# Vivado block design soc, xc7z045ffg900-2, Vivado 2017.3
# (continued, part 2 of 2)
current_bd_instance /datapath/index_cont

create_bd_cell -type ip -vlnv xilinx.com:ip:c_counter_binary:12.0 c_counter_binary_0
set_property -dict [list \
  CONFIG.Implementation Fabric \
  CONFIG.Output_Width 32 \
  CONFIG.Increment_Value 4 \
  CONFIG.Restrict_Count true \
  CONFIG.Final_Count_Value 1FFC \
  CONFIG.CE true \
  CONFIG.SCLR true \
] [get_bd_cells c_counter_binary_0]

# ---- hierarchy /datapath/max_cont ----
current_bd_instance /datapath/max_cont
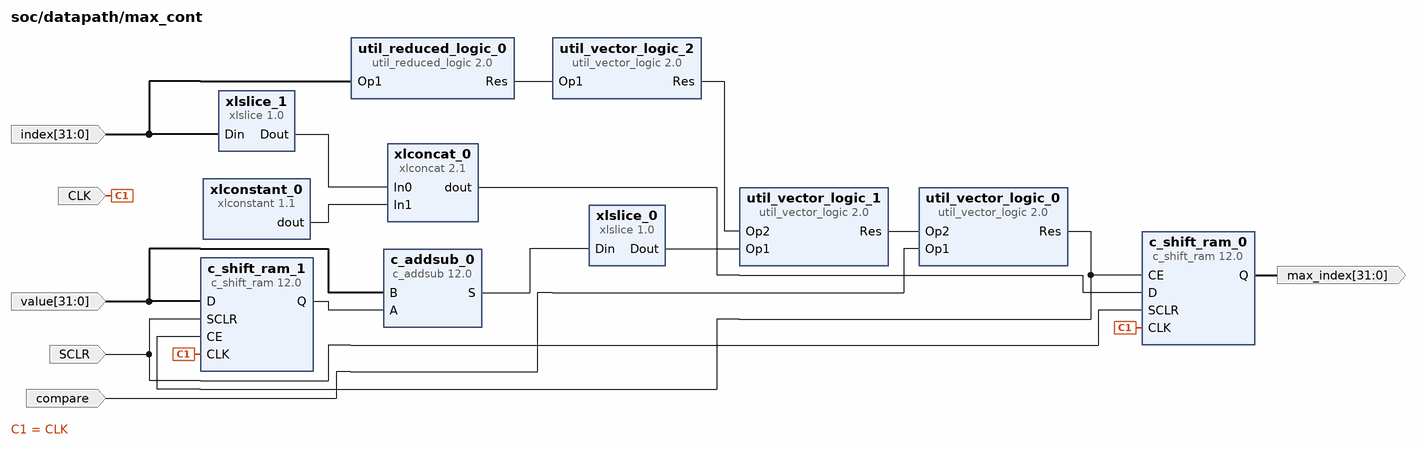
[diagram p15: block diagram inside /datapath/max_cont]
create_bd_pin -dir I -from 31 -to 0 index
create_bd_pin -dir I CLK
create_bd_pin -dir I SCLR
create_bd_pin -dir I compare
create_bd_pin -dir O -from 31 -to 0 max_index
create_bd_pin -dir I -from 31 -to 0 value

create_bd_cell -type ip -vlnv xilinx.com:ip:c_shift_ram:12.0 c_shift_ram_0
set_property -dict [list \
  CONFIG.CE true \
  CONFIG.Width 32 \
  CONFIG.Depth 1 \
  CONFIG.DefaultData 00000000000000000000000000000000 \
  CONFIG.AsyncInitVal 00000000000000000000000000000000 \
  CONFIG.SCLR true \
] [get_bd_cells c_shift_ram_0]
create_bd_cell -type ip -vlnv xilinx.com:ip:c_shift_ram:12.0 c_shift_ram_1
set_property -dict [list \
  CONFIG.CE true \
  CONFIG.Width 32 \
  CONFIG.Depth 1 \
  CONFIG.DefaultData 00000000000000000000000000000000 \
  CONFIG.AsyncInitVal 00000000000000000000000000000000 \
  CONFIG.SCLR true \
] [get_bd_cells c_shift_ram_1]
create_bd_cell -type ip -vlnv xilinx.com:ip:util_vector_logic:2.0 util_vector_logic_0
set_property -dict {CONFIG.C_SIZE 1} [get_bd_cells util_vector_logic_0]
create_bd_cell -type ip -vlnv xilinx.com:ip:c_addsub:12.0 c_addsub_0
set_property -dict [list \
  CONFIG.A_Width 32 \
  CONFIG.B_Width 32 \
  CONFIG.Add_Mode Subtract \
  CONFIG.Out_Width 32 \
  CONFIG.Latency 0 \
  CONFIG.B_Value 00000000000000000000000000000000 \
  CONFIG.CE false \
] [get_bd_cells c_addsub_0]
create_bd_cell -type ip -vlnv xilinx.com:ip:xlslice:1.0 xlslice_0
set_property -dict {CONFIG.DIN_TO 31 CONFIG.DIN_FROM 31 CONFIG.DIN_WIDTH 32 CONFIG.DOUT_WIDTH 1} [get_bd_cells xlslice_0]
create_bd_cell -type ip -vlnv xilinx.com:ip:xlslice:1.0 xlslice_1
set_property -dict {CONFIG.DIN_TO 2 CONFIG.DIN_FROM 31 CONFIG.DOUT_WIDTH 30} [get_bd_cells xlslice_1]
create_bd_cell -type ip -vlnv xilinx.com:ip:xlconcat:2.1 xlconcat_0
set_property -dict {CONFIG.IN0_WIDTH 30 CONFIG.IN1_WIDTH 2} [get_bd_cells xlconcat_0]
create_bd_cell -type ip -vlnv xilinx.com:ip:xlconstant:1.1 xlconstant_0
set_property -dict {CONFIG.CONST_WIDTH 2 CONFIG.CONST_VAL 0} [get_bd_cells xlconstant_0]
create_bd_cell -type ip -vlnv xilinx.com:ip:util_vector_logic:2.0 util_vector_logic_1
set_property -dict {CONFIG.C_SIZE 1 CONFIG.C_OPERATION or} [get_bd_cells util_vector_logic_1]
create_bd_cell -type ip -vlnv xilinx.com:ip:util_reduced_logic:2.0 util_reduced_logic_0
set_property -dict {CONFIG.C_SIZE 32 CONFIG.C_OPERATION or} [get_bd_cells util_reduced_logic_0]
create_bd_cell -type ip -vlnv xilinx.com:ip:util_vector_logic:2.0 util_vector_logic_2
set_property -dict {CONFIG.C_SIZE 1 CONFIG.C_OPERATION not} [get_bd_cells util_vector_logic_2]

# ---- connections ----

current_bd_instance /control_unit
connect_bd_net -net processing_system7_0_FCLK_CLK1 [get_bd_pins CLK] [get_bd_pins avg_err_state/CLK] [get_bd_pins acc_state/CLK]
connect_bd_net [get_bd_pins do_cycle] [get_bd_pins acc_state/do_cycle]
connect_bd_net [get_bd_pins avg_err_state/s_3] [get_bd_pins s_restart] [get_bd_pins util_vector_logic_0/Op1]
connect_bd_net [get_bd_pins acc_state/s_2] [get_bd_pins s_acc]
connect_bd_net [get_bd_pins acc_state/s_3] [get_bd_pins s_addr]
connect_bd_net -net len_cont_not_zero [get_bd_pins len_not_zero] [get_bd_pins avg_err_state/len_not_zero]
connect_bd_net -net cycle_cont_stop_cycle [get_bd_pins stop_cycle] [get_bd_pins avg_err_state/stop_cycle]
connect_bd_net -net util_vector_logic_0_Res [get_bd_pins valid_div] [get_bd_pins avg_err_state/valid_div]
connect_bd_net -net util_vector_logic_1_Res [get_bd_pins valid_sqrt] [get_bd_pins avg_err_state/valid_sqrt]
connect_bd_net [get_bd_pins avg_err_state/s_5] [get_bd_pins s_root]
connect_bd_net [get_bd_pins avg_err_state/s_4] [get_bd_pins s_square]
connect_bd_net [get_bd_pins avg_err_state/s_2] [get_bd_pins s_avg]
connect_bd_net [get_bd_pins avg_err_state/s_0] [get_bd_pins s_wait]
connect_bd_net [get_bd_pins addr_zero] [get_bd_pins avg_err_state/addr_zero]
connect_bd_net [get_bd_pins valid_zncc] [get_bd_pins avg_err_state/valid_zncc]
connect_bd_net [get_bd_pins avg_err_state/s_6] [get_bd_pins s_zncc]
connect_bd_net [get_bd_pins avg_err_state/s_7] [get_bd_pins s_done]
connect_bd_net [get_bd_pins SCLR] [get_bd_pins util_vector_logic_0/Op2] [get_bd_pins avg_err_state/SCLR]
connect_bd_net [get_bd_pins util_vector_logic_0/Res] [get_bd_pins acc_state/SCLR]
connect_bd_net [get_bd_pins xlconcat_0/dout] [get_bd_pins states]
connect_bd_net [get_bd_pins acc_state/state] [get_bd_pins xlconcat_0/In0]
connect_bd_net [get_bd_pins avg_err_state/state] [get_bd_pins xlconcat_0/In1]
connect_bd_net [get_bd_pins xlconstant_0/dout] [get_bd_pins xlconcat_0/In2]

current_bd_instance /control_unit/acc_state
connect_bd_net -net processing_system7_0_FCLK_CLK1 [get_bd_pins CLK] [get_bd_pins c_counter_binary_0/CLK]
connect_bd_net [get_bd_pins SCLR] [get_bd_pins c_counter_binary_0/SCLR]
connect_bd_net [get_bd_pins c_counter_binary_0/Q] [get_bd_pins state] [get_bd_pins x_0/Din] [get_bd_pins x_1/Din]
connect_bd_net [get_bd_pins x_0/Dout] [get_bd_pins n_x_0/Op1] [get_bd_pins s_1/Op1] [get_bd_pins s_3/Op1]
connect_bd_net [get_bd_pins x_1/Dout] [get_bd_pins n_x_1/Op1] [get_bd_pins s_2/Op2] [get_bd_pins s_3/Op2]
connect_bd_net [get_bd_pins n_x_0/Res] [get_bd_pins s_0/Op1] [get_bd_pins s_2/Op1]
connect_bd_net [get_bd_pins n_x_1/Res] [get_bd_pins s_0/Op2] [get_bd_pins s_1/Op2]
connect_bd_net [get_bd_pins s_0/Res] [get_bd_pins s_0] [get_bd_pins s_0_c/Op2]
connect_bd_net [get_bd_pins s_1/Res] [get_bd_pins s_1] [get_bd_pins xlconcat_0/In1]
connect_bd_net [get_bd_pins s_2/Res] [get_bd_pins s_2] [get_bd_pins xlconcat_0/In2]
connect_bd_net [get_bd_pins s_3/Res] [get_bd_pins s_3] [get_bd_pins xlconcat_0/In3]
connect_bd_net [get_bd_pins xlconcat_0/dout] [get_bd_pins util_reduced_logic_0/Op1]
connect_bd_net [get_bd_pins util_reduced_logic_0/Res] [get_bd_pins c_counter_binary_0/CE]
connect_bd_net [get_bd_pins do_cycle] [get_bd_pins s_0_c/Op1]
connect_bd_net [get_bd_pins s_0_c/Res] [get_bd_pins xlconcat_0/In0]

current_bd_instance /control_unit/avg_err_state
connect_bd_net -net processing_system7_0_FCLK_CLK1 [get_bd_pins CLK] [get_bd_pins c_counter_binary_0/CLK]
connect_bd_net [get_bd_pins c_counter_binary_0/Q] \
  [get_bd_pins state] [get_bd_pins x_2/Din] [get_bd_pins x_3/Din] [get_bd_pins x_1/Din] [get_bd_pins x_0/Din]
connect_bd_net [get_bd_pins x_0/Dout] [get_bd_pins c_1/In0] [get_bd_pins c_3/In0] [get_bd_pins c_5/In0] [get_bd_pins c_7/In0] [get_bd_pins n_x_0/Op1]
connect_bd_net [get_bd_pins x_2/Dout] [get_bd_pins c_4/In2] [get_bd_pins c_5/In2] [get_bd_pins c_6/In2] [get_bd_pins c_7/In2] [get_bd_pins n_x_2/Op1]
connect_bd_net [get_bd_pins n_x_0/Res] [get_bd_pins c_0/In0] [get_bd_pins c_2/In0] [get_bd_pins c_4/In0] [get_bd_pins c_6/In0] [get_bd_pins c_8/In0]
connect_bd_net [get_bd_pins n_x_1/Res] [get_bd_pins c_0/In1] [get_bd_pins c_1/In1] [get_bd_pins c_4/In1] [get_bd_pins c_5/In1] [get_bd_pins c_8/In1]
connect_bd_net [get_bd_pins n_x_2/Res] [get_bd_pins c_0/In2] [get_bd_pins c_1/In2] [get_bd_pins c_2/In2] [get_bd_pins c_3/In2] [get_bd_pins c_8/In2]
connect_bd_net [get_bd_pins n_x_3/Res] \
  [get_bd_pins c_0/In3] [get_bd_pins c_1/In3] [get_bd_pins c_2/In3] [get_bd_pins c_3/In3] [get_bd_pins c_4/In3] \
  [get_bd_pins c_5/In3] [get_bd_pins c_6/In3] [get_bd_pins c_7/In3]
connect_bd_net [get_bd_pins c_0/dout] [get_bd_pins s_0/Op1]
connect_bd_net [get_bd_pins c_1/dout] [get_bd_pins s_1/Op1]
connect_bd_net [get_bd_pins x_1/Dout] [get_bd_pins c_2/In1] [get_bd_pins c_3/In1] [get_bd_pins c_6/In1] [get_bd_pins c_7/In1] [get_bd_pins n_x_1/Op1]
connect_bd_net [get_bd_pins c_2/dout] [get_bd_pins s_2/Op1]
connect_bd_net [get_bd_pins c_3/dout] [get_bd_pins s_3/Op1]
connect_bd_net [get_bd_pins c_4/dout] [get_bd_pins s_4/Op1]
connect_bd_net [get_bd_pins c_5/dout] [get_bd_pins s_5/Op1]
connect_bd_net [get_bd_pins c_6/dout] [get_bd_pins s_6/Op1]
connect_bd_net [get_bd_pins c_7/dout] [get_bd_pins s_7/Op1]
connect_bd_net -net slicer_cont_x_3 [get_bd_pins x_3/Dout] [get_bd_pins c_8/In3] [get_bd_pins n_x_3/Op1]
connect_bd_net [get_bd_pins c_8/dout] [get_bd_pins s_8/Op1]
connect_bd_net [get_bd_pins s_3/Res] [get_bd_pins s_3] [get_bd_pins util_vector_logic_5/Op1]
connect_bd_net [get_bd_pins s_8/Res] [get_bd_pins s_8] [get_bd_pins util_vector_logic_7/Op1]
connect_bd_net [get_bd_pins s_5/Res] [get_bd_pins s_5] [get_bd_pins util_vector_logic_4/Op1]
connect_bd_net [get_bd_pins s_4/Res] [get_bd_pins s_4] [get_bd_pins util_vector_logic_3/Op1]
connect_bd_net [get_bd_pins s_6/Res] [get_bd_pins s_6] [get_bd_pins util_vector_logic_6/Op1]
connect_bd_net [get_bd_pins s_7/Res] [get_bd_pins s_7] [get_bd_pins xlconcat_0/In7]
connect_bd_net [get_bd_pins s_1/Res] [get_bd_pins s_1] [get_bd_pins util_vector_logic_1/Op1]
connect_bd_net [get_bd_pins s_2/Res] [get_bd_pins s_2] [get_bd_pins util_vector_logic_2/Op1]
connect_bd_net [get_bd_pins s_0/Res] [get_bd_pins s_0] [get_bd_pins util_vector_logic_0/Op1]
connect_bd_net -net avg_err_logic_enable [get_bd_pins util_reduced_logic_0/Res] [get_bd_pins c_counter_binary_0/CE]
connect_bd_net [get_bd_pins len_not_zero] [get_bd_pins util_vector_logic_0/Op2]
connect_bd_net [get_bd_pins stop_cycle] [get_bd_pins util_vector_logic_1/Op2] [get_bd_pins util_vector_logic_3/Op2]
connect_bd_net [get_bd_pins valid_div] [get_bd_pins util_vector_logic_2/Op2]
connect_bd_net [get_bd_pins valid_sqrt] [get_bd_pins util_vector_logic_4/Op2]
connect_bd_net [get_bd_pins util_vector_logic_0/Res] [get_bd_pins xlconcat_0/In0]
connect_bd_net [get_bd_pins util_vector_logic_1/Res] [get_bd_pins xlconcat_0/In1]
connect_bd_net [get_bd_pins util_vector_logic_2/Res] [get_bd_pins xlconcat_0/In2]
connect_bd_net [get_bd_pins util_vector_logic_3/Res] [get_bd_pins xlconcat_0/In4]
connect_bd_net [get_bd_pins util_vector_logic_4/Res] [get_bd_pins xlconcat_0/In5]
connect_bd_net [get_bd_pins xlconcat_0/dout] [get_bd_pins util_reduced_logic_0/Op1]
connect_bd_net [get_bd_pins util_vector_logic_5/Res] [get_bd_pins xlconcat_0/In3]
connect_bd_net [get_bd_pins addr_zero] [get_bd_pins util_vector_logic_5/Op2]
connect_bd_net [get_bd_pins util_vector_logic_6/Res] [get_bd_pins xlconcat_0/In6]
connect_bd_net [get_bd_pins valid_zncc] [get_bd_pins util_vector_logic_6/Op2]
connect_bd_net [get_bd_pins xlconstant_0/dout] [get_bd_pins xlconcat_0/In8]
connect_bd_net [get_bd_pins util_vector_logic_7/Res] [get_bd_pins c_counter_binary_0/SCLR]
connect_bd_net [get_bd_pins SCLR] [get_bd_pins util_vector_logic_7/Op2]

current_bd_instance /datapath
connect_bd_intf_net -intf_net axi_bram_ctrl_0_BRAM_PORTA1 [get_bd_intf_pins BRAM_PORTA0] [get_bd_intf_pins bram_pair/BRAM_PORTA1]
connect_bd_intf_net -intf_net axi_bram_ctrl_0_BRAM_PORTA [get_bd_intf_pins BRAM_PORTA1] [get_bd_intf_pins bram_pair/BRAM_PORTA0]
connect_bd_intf_net [get_bd_intf_pins BRAM_PORTA2] [get_bd_intf_pins bram_res/BRAM_PORTA]
connect_bd_net [get_bd_pins addr_cont/addr] [get_bd_pins cycle_cont/addr] [get_bd_pins bram_pair/addr] [get_bd_pins acc_group/addr]
connect_bd_net [get_bd_pins len_cont/len_off] [get_bd_pins cycle_cont/len]
connect_bd_net -net bram_cont_long_sel [get_bd_pins bram_pair/long_sel_0] [get_bd_pins len_cont/len_in] [get_bd_pins acc_group/long_in0]
connect_bd_net -net long_in_1 [get_bd_pins bram_pair/long_sel_1] [get_bd_pins acc_group/long_in1]
connect_bd_net -net divisor_1 [get_bd_pins len_cont/len] [get_bd_pins avg_pair/divisor]
connect_bd_net -net util_vector_logic_1_Res [get_bd_pins err_pair/valid_sqrt] [get_bd_pins valid_sqrt]
connect_bd_net -net processing_system7_0_FCLK_CLK1 [get_bd_pins CLK] \
  [get_bd_pins len_cont/CLK] [get_bd_pins bram_pair/CLK] [get_bd_pins avg_pair/CLK] [get_bd_pins acc_group/CLK] \
  [get_bd_pins err_pair/CLK] [get_bd_pins zncc_cont/CLK] [get_bd_pins bram_res/CLK] [get_bd_pins index_cont/CLK] \
  [get_bd_pins addr_cont/CLK] [get_bd_pins max_cont/CLK]
connect_bd_net -net avg_err_state_s_5 [get_bd_pins s_root] [get_bd_pins err_pair/s_root]
connect_bd_net -net do_cycle_1 [get_bd_pins cycle_cont/do_cycle] [get_bd_pins do_cycle]
connect_bd_net [get_bd_pins cycle_cont/stop_cycle] [get_bd_pins stop_cycle]
connect_bd_net [get_bd_pins len_cont/not_zero] [get_bd_pins len_not_zero] [get_bd_pins cycle_cont/len_not_zero] [get_bd_pins bram_pair/clear_len]
connect_bd_net -net acc_state_s_2 [get_bd_pins s_acc] [get_bd_pins acc_group/s_acc]
connect_bd_net -net avg_err_state_s_3 [get_bd_pins s_restart] [get_bd_pins acc_group/s_restart] [get_bd_pins addr_cont/s_restart]
connect_bd_net -net avg_err_state_s_4 [get_bd_pins s_square] [get_bd_pins acc_group/s_square]
connect_bd_net -net acc_state_s_3 [get_bd_pins s_addr] [get_bd_pins addr_cont/CE]
connect_bd_net -net addr_zero_1 [get_bd_pins addr_cont/zero] [get_bd_pins addr_zero]
connect_bd_net -net avg_err_state_s_0 [get_bd_pins s_wait] [get_bd_pins len_cont/CE]
connect_bd_net -net avg_err_state_s_2 [get_bd_pins s_avg] [get_bd_pins avg_pair/s_avg]
connect_bd_net -net avg0_1 [get_bd_pins avg_pair/avg0] [get_bd_pins acc_group/avg0]
connect_bd_net [get_bd_pins avg_pair/avg1] [get_bd_pins acc_group/avg1]
connect_bd_net [get_bd_pins acc_group/acc0] [get_bd_pins avg_pair/dividend0] [get_bd_pins err_pair/num0]
connect_bd_net [get_bd_pins acc_group/acc1] [get_bd_pins avg_pair/dividend1] [get_bd_pins err_pair/num1]
connect_bd_net [get_bd_pins avg_pair/valid_div] [get_bd_pins valid_div]
connect_bd_net [get_bd_pins err_pair/norm] [get_bd_pins zncc_cont/norm]
connect_bd_net [get_bd_pins acc_group/acc2] [get_bd_pins zncc_cont/cc]
connect_bd_net [get_bd_pins s_zncc] [get_bd_pins zncc_cont/s_zncc] [get_bd_pins len_cont/s_zncc] [get_bd_pins addr_cont/s_zncc]
connect_bd_net [get_bd_pins zncc_cont/valid_zncc] [get_bd_pins valid_zncc] [get_bd_pins bram_res/save] [get_bd_pins max_cont/compare]
connect_bd_net [get_bd_pins zncc_cont/zncc] [get_bd_pins debug_2] [get_bd_pins bram_res/zncc_val] [get_bd_pins max_cont/value]
connect_bd_net [get_bd_pins s_done] [get_bd_pins index_cont/s_done] [get_bd_pins acc_group/s_done]
connect_bd_net -net c_counter_binary_0_Q [get_bd_pins index_cont/index] [get_bd_pins bram_res/index] [get_bd_pins max_cont/index]
connect_bd_net -net SCLR_1 [get_bd_pins len_cont/clear] \
  [get_bd_pins clear] [get_bd_pins index_cont/SCLR] [get_bd_pins addr_cont/SCLR] [get_bd_pins acc_group/SCLR] \
  [get_bd_pins max_cont/SCLR]
connect_bd_net [get_bd_pins max_cont/max_index] [get_bd_pins max_index]

current_bd_instance /datapath/cycle_cont
connect_bd_net [get_bd_pins c_addsub_0/S] [get_bd_pins xlslice_0/Din]
connect_bd_net -net c_counter_binary_0_Q [get_bd_pins addr] [get_bd_pins c_addsub_0/A]
connect_bd_net -net len_cont_len [get_bd_pins len] [get_bd_pins c_addsub_0/B]
connect_bd_net [get_bd_pins util_vector_logic_0/Res] [get_bd_pins stop_cycle]
connect_bd_net [get_bd_pins len_not_zero] [get_bd_pins util_vector_logic_1/Op2]
connect_bd_net [get_bd_pins xlslice_0/Dout] [get_bd_pins util_vector_logic_1/Op1]
connect_bd_net [get_bd_pins util_vector_logic_1/Res] [get_bd_pins do_cycle] [get_bd_pins util_vector_logic_0/Op1]

current_bd_instance /datapath/addr_cont
connect_bd_net [get_bd_pins c_counter_binary_0/Q] [get_bd_pins addr] [get_bd_pins util_reduced_logic_0/Op1]
connect_bd_net [get_bd_pins CE] [get_bd_pins c_counter_binary_0/CE]
connect_bd_net [get_bd_pins util_reduced_logic_0/Res] [get_bd_pins not_zero] [get_bd_pins util_vector_logic_0/Op1]
connect_bd_net [get_bd_pins util_vector_logic_0/Res] [get_bd_pins zero]
connect_bd_net [get_bd_pins CLK] [get_bd_pins c_counter_binary_0/CLK]
connect_bd_net -net s_reset_1 [get_bd_pins s_restart] [get_bd_pins util_vector_logic_1/Op1]
connect_bd_net [get_bd_pins util_vector_logic_1/Res] [get_bd_pins util_vector_logic_2/Op1]
connect_bd_net [get_bd_pins s_zncc] [get_bd_pins util_vector_logic_1/Op2]
connect_bd_net [get_bd_pins SCLR] [get_bd_pins util_vector_logic_2/Op2]
connect_bd_net [get_bd_pins util_vector_logic_2/Res] [get_bd_pins c_counter_binary_0/SCLR]

current_bd_instance /datapath/len_cont
connect_bd_net -net axi_bram_ctrl_0_bram_doutb [get_bd_pins len_in] [get_bd_pins c_shift_ram_0/D]
connect_bd_net -net processing_system7_0_FCLK_CLK1 [get_bd_pins CLK] [get_bd_pins c_shift_ram_0/CLK]
connect_bd_net [get_bd_pins c_shift_ram_0/Q] \
  [get_bd_pins len] [get_bd_pins util_reduced_logic_0/Op1] [get_bd_pins c_addsub_0/A] [get_bd_pins util_reduced_logic_1/Op1]
connect_bd_net [get_bd_pins CE] [get_bd_pins c_shift_ram_0/CE]
connect_bd_net [get_bd_pins util_reduced_logic_0/Res] [get_bd_pins not_zero] [get_bd_pins util_vector_logic_0/Op1]
connect_bd_net [get_bd_pins util_vector_logic_0/Res] [get_bd_pins zero]
connect_bd_net [get_bd_pins c_addsub_0/S] [get_bd_pins len_off]
connect_bd_net [get_bd_pins util_reduced_logic_1/Res] [get_bd_pins clear] [get_bd_pins util_vector_logic_1/Op2]
connect_bd_net [get_bd_pins s_zncc] [get_bd_pins util_vector_logic_1/Op1]
connect_bd_net [get_bd_pins util_vector_logic_1/Res] [get_bd_pins c_shift_ram_0/SCLR]

current_bd_instance /datapath/bram_pair
connect_bd_intf_net -intf_net axi_bram_ctrl_0_BRAM_PORTA [get_bd_intf_pins BRAM_PORTA0] [get_bd_intf_pins axi_bram_ctrl_0_bram_1/BRAM_PORTA]
connect_bd_intf_net -intf_net axi_bram_ctrl_0_BRAM_PORTA1 [get_bd_intf_pins BRAM_PORTA1] [get_bd_intf_pins axi_bram_ctrl_0_bram/BRAM_PORTA]
connect_bd_net -net processing_system7_0_FCLK_CLK1 [get_bd_pins CLK] [get_bd_pins axi_bram_ctrl_0_bram/clkb] [get_bd_pins axi_bram_ctrl_0_bram_1/clkb]
connect_bd_net -net addr_cont_addr [get_bd_pins addr] \
  [get_bd_pins axi_bram_ctrl_0_bram/addrb] [get_bd_pins axi_bram_ctrl_0_bram_1/addrb] [get_bd_pins xlslice_7/Din]
connect_bd_net -net bram_cont_long_sel [get_bd_pins axi_bram_ctrl_0_bram_1/doutb] [get_bd_pins long_sel_0]
connect_bd_net -net long_in_1 [get_bd_pins axi_bram_ctrl_0_bram/doutb] [get_bd_pins long_sel_1]
connect_bd_net -net xlconstant_0_dout_1 [get_bd_pins xlconstant_1/dout] \
  [get_bd_pins axi_bram_ctrl_0_bram_1/enb] [get_bd_pins axi_bram_ctrl_0_bram/enb]
connect_bd_net [get_bd_pins xlconstant_0/dout] [get_bd_pins axi_bram_ctrl_0_bram_1/dinb]
connect_bd_net [get_bd_pins xlconcat_0/dout] [get_bd_pins axi_bram_ctrl_0_bram_1/web]
connect_bd_net -net xlslice_3_Dout_1 [get_bd_pins xlslice_7/Dout] [get_bd_pins util_reduced_logic_1/Op1]
connect_bd_net [get_bd_pins util_vector_logic_1/Res] \
  [get_bd_pins xlconcat_0/In0] [get_bd_pins xlconcat_0/In1] [get_bd_pins xlconcat_0/In2] [get_bd_pins xlconcat_0/In3]
connect_bd_net [get_bd_pins util_reduced_logic_1/Res] [get_bd_pins util_vector_logic_2/Op1]
connect_bd_net [get_bd_pins util_vector_logic_2/Res] [get_bd_pins util_vector_logic_1/Op1]
connect_bd_net -net clear_current_1 [get_bd_pins clear_len] [get_bd_pins util_vector_logic_1/Op2]

current_bd_instance /datapath/avg_pair
connect_bd_net -net avg_in0_1 [get_bd_pins xlslice_0/Dout] [get_bd_pins c_shift_ram_0/D]
connect_bd_net -net avg_in1_1 [get_bd_pins xlslice_1/Dout] [get_bd_pins c_shift_ram_1/D]
connect_bd_net -net div_cont1_valid_out [get_bd_pins div_gen_1/m_axis_dout_tvalid] \
  [get_bd_pins util_vector_logic_0/Op2] [get_bd_pins c_shift_ram_1/CE]
connect_bd_net -net processing_system7_0_FCLK_CLK1 [get_bd_pins CLK] \
  [get_bd_pins c_shift_ram_0/CLK] [get_bd_pins c_shift_ram_1/CLK] [get_bd_pins div_gen_0/aclk] [get_bd_pins div_gen_1/aclk]
connect_bd_net -net div_cont_valid_out [get_bd_pins div_gen_0/m_axis_dout_tvalid] [get_bd_pins util_vector_logic_0/Op1] [get_bd_pins c_shift_ram_0/CE]
connect_bd_net -net avg_pair_avg0 [get_bd_pins c_shift_ram_0/Q] [get_bd_pins avg0]
connect_bd_net -net avg_pair_avg1 [get_bd_pins c_shift_ram_1/Q] [get_bd_pins avg1]
connect_bd_net -net avg_err_state_s_2 [get_bd_pins s_avg] \
  [get_bd_pins div_gen_0/s_axis_dividend_tvalid] [get_bd_pins div_gen_0/s_axis_divisor_tvalid] \
  [get_bd_pins div_gen_1/s_axis_dividend_tvalid] [get_bd_pins div_gen_1/s_axis_divisor_tvalid]
connect_bd_net [get_bd_pins divisor] [get_bd_pins div_gen_0/s_axis_divisor_tdata] [get_bd_pins div_gen_1/s_axis_divisor_tdata]
connect_bd_net [get_bd_pins div_gen_0/m_axis_dout_tdata] [get_bd_pins xlslice_0/Din]
connect_bd_net -net div_gen_0_m_axis_dout_tdata_1 [get_bd_pins div_gen_1/m_axis_dout_tdata] [get_bd_pins xlslice_1/Din]
connect_bd_net -net s_axis_dividend_tdata_0_1 [get_bd_pins dividend0] [get_bd_pins div_gen_0/s_axis_dividend_tdata]
connect_bd_net -net s_axis_dividend_tdata_1_1 [get_bd_pins dividend1] [get_bd_pins div_gen_1/s_axis_dividend_tdata]
connect_bd_net [get_bd_pins util_vector_logic_0/Res] [get_bd_pins valid_div]

current_bd_instance /datapath/acc_group
connect_bd_net -net processing_system7_0_FCLK_CLK1 [get_bd_pins CLK] \
  [get_bd_pins xbip_dsp48_macro_0/CLK] [get_bd_pins xbip_dsp48_macro_3/CLK] [get_bd_pins xbip_dsp48_macro_6/CLK]
connect_bd_net -net acc_state_s_2 [get_bd_pins s_acc] [get_bd_pins util_vector_logic_1/Op2]
connect_bd_net -net avg_err_state_s_3 [get_bd_pins util_vector_logic_0/Res] \
  [get_bd_pins xbip_dsp48_macro_0/SCLR] [get_bd_pins xbip_dsp48_macro_3/SCLR] [get_bd_pins xbip_dsp48_macro_6/SCLR]
connect_bd_net -net avg_err_state_s_4 [get_bd_pins s_square] \
  [get_bd_pins xbip_dsp48_macro_0/SEL] [get_bd_pins xbip_dsp48_macro_3/SEL] [get_bd_pins xlconcat_9/In1]
connect_bd_net -net addr_cont_addr [get_bd_pins addr] [get_bd_pins xlslice_5/Din] [get_bd_pins xlslice_7/Din]
connect_bd_net -net util_vector_logic_0_Res_1 [get_bd_pins util_vector_logic_1/Res] \
  [get_bd_pins xbip_dsp48_macro_3/CE] [get_bd_pins xbip_dsp48_macro_0/CE] [get_bd_pins xbip_dsp48_macro_6/CE]
connect_bd_net -net xlslice_1_Dout_1 [get_bd_pins xlslice_5/Dout] \
  [get_bd_pins xbip_dsp48_macro_1/SEL] [get_bd_pins xbip_dsp48_macro_4/SEL] [get_bd_pins xlconcat_9/In0]
connect_bd_net -net xlconcat_0_dout2 [get_bd_pins xlconcat_9/dout] [get_bd_pins xbip_dsp48_macro_2/SEL] [get_bd_pins xbip_dsp48_macro_5/SEL]
connect_bd_net -net avg1_1 [get_bd_pins avg1] [get_bd_pins xbip_dsp48_macro_2/C]
connect_bd_net -net avg0_1 [get_bd_pins avg0] [get_bd_pins xbip_dsp48_macro_5/C]
connect_bd_net -net long_in1_1 [get_bd_pins long_in1] [get_bd_pins b_10/Din] [get_bd_pins b_12/Din] [get_bd_pins b_13/Din] [get_bd_pins b_11/Din]
connect_bd_net -net long_in0_1 [get_bd_pins long_in0] [get_bd_pins b_02/Din] [get_bd_pins b_01/Din] [get_bd_pins b_03/Din] [get_bd_pins b_00/Din]
connect_bd_net [get_bd_pins xbip_dsp48_macro_3/P] [get_bd_pins acc0]
connect_bd_net [get_bd_pins xbip_dsp48_macro_0/P] [get_bd_pins acc1]
connect_bd_net [get_bd_pins xbip_dsp48_macro_6/P] [get_bd_pins acc2]
connect_bd_net -net byte_adapter_db_00 [get_bd_pins xlconcat_5/dout] [get_bd_pins xbip_dsp48_macro_4/A]
connect_bd_net -net byte_adapter_db_01 [get_bd_pins xlconcat_6/dout] [get_bd_pins xbip_dsp48_macro_4/C]
connect_bd_net -net byte_adapter_db_02 [get_bd_pins xlconcat_7/dout] [get_bd_pins xbip_dsp48_macro_4/D]
connect_bd_net -net xbip_dsp48_macro_1_P_1 [get_bd_pins xbip_dsp48_macro_4/P] [get_bd_pins xbip_dsp48_macro_5/A]
connect_bd_net -net byte_adapter_db_03 [get_bd_pins xlconcat_8/dout] [get_bd_pins xbip_dsp48_macro_5/D]
connect_bd_net -net byte_adapter_db_10 [get_bd_pins xlconcat_1/dout] [get_bd_pins xbip_dsp48_macro_1/A]
connect_bd_net -net byte_adapter_db_11 [get_bd_pins xlconcat_2/dout] [get_bd_pins xbip_dsp48_macro_1/C]
connect_bd_net -net byte_adapter_db_12 [get_bd_pins xlconcat_3/dout] [get_bd_pins xbip_dsp48_macro_1/D]
connect_bd_net [get_bd_pins xbip_dsp48_macro_1/P] [get_bd_pins xbip_dsp48_macro_2/A]
connect_bd_net -net byte_adapter_db_13 [get_bd_pins xlconcat_4/dout] [get_bd_pins xbip_dsp48_macro_2/D]
connect_bd_net -net b_1_Dout [get_bd_pins b_11/Dout] [get_bd_pins xlconcat_2/In1]
connect_bd_net -net b_2_Dout [get_bd_pins b_12/Dout] [get_bd_pins xlconcat_3/In1]
connect_bd_net -net b_3_Dout [get_bd_pins b_13/Dout] [get_bd_pins xlconcat_4/In1]
connect_bd_net -net b_0_Dout_1 [get_bd_pins b_00/Dout] [get_bd_pins xlconcat_5/In1]
connect_bd_net -net b_1_Dout_1 [get_bd_pins b_01/Dout] [get_bd_pins xlconcat_6/In1]
connect_bd_net [get_bd_pins xlconstant_0/dout] \
  [get_bd_pins xlconcat_2/In0] [get_bd_pins xlconcat_1/In0] [get_bd_pins xlconcat_3/In0] [get_bd_pins xlconcat_4/In0] \
  [get_bd_pins xlconcat_6/In0] [get_bd_pins xlconcat_5/In0] [get_bd_pins xlconcat_7/In0] [get_bd_pins xlconcat_8/In0]
connect_bd_net -net b_0_Dout [get_bd_pins b_10/Dout] [get_bd_pins xlconcat_1/In1]
connect_bd_net [get_bd_pins xlconstant_2/dout] \
  [get_bd_pins xlconcat_2/In2] [get_bd_pins xlconcat_1/In2] [get_bd_pins xlconcat_3/In2] [get_bd_pins xlconcat_4/In2] \
  [get_bd_pins xlconcat_6/In2] [get_bd_pins xlconcat_5/In2] [get_bd_pins xlconcat_7/In2] [get_bd_pins xlconcat_8/In2]
connect_bd_net -net b_2_Dout_1 [get_bd_pins b_02/Dout] [get_bd_pins xlconcat_7/In1]
connect_bd_net -net b_3_Dout_1 [get_bd_pins b_03/Dout] [get_bd_pins xlconcat_8/In1]
connect_bd_net -net util_reduced_logic_0_Res_1 [get_bd_pins util_reduced_logic_1/Res] [get_bd_pins util_vector_logic_1/Op1]
connect_bd_net -net xlslice_3_Dout_1 [get_bd_pins xlslice_7/Dout] [get_bd_pins util_reduced_logic_1/Op1]
connect_bd_net [get_bd_pins xbip_dsp48_macro_5/P] [get_bd_pins xlslice_0/Din]
connect_bd_net [get_bd_pins xlslice_0/Dout] [get_bd_pins xbip_dsp48_macro_3/A] [get_bd_pins xbip_dsp48_macro_3/B] [get_bd_pins xbip_dsp48_macro_6/A]
connect_bd_net [get_bd_pins xbip_dsp48_macro_2/P] [get_bd_pins xlslice_1/Din]
connect_bd_net [get_bd_pins xlslice_1/Dout] [get_bd_pins xbip_dsp48_macro_0/A] [get_bd_pins xbip_dsp48_macro_0/B] [get_bd_pins xbip_dsp48_macro_6/B]
connect_bd_net [get_bd_pins s_restart] [get_bd_pins util_vector_logic_2/Op2]
connect_bd_net [get_bd_pins s_done] [get_bd_pins util_vector_logic_0/Op2]
connect_bd_net [get_bd_pins SCLR] [get_bd_pins util_vector_logic_2/Op1]
connect_bd_net [get_bd_pins util_vector_logic_2/Res] [get_bd_pins util_vector_logic_0/Op1]

current_bd_instance /datapath/err_pair
connect_bd_net -net valid_sqrt_1 [get_bd_pins cordic_0/m_axis_dout_tvalid] [get_bd_pins util_vector_logic_1/Op1]
connect_bd_net -net sqrt_cont1_valid_out [get_bd_pins cordic_1/m_axis_dout_tvalid] [get_bd_pins util_vector_logic_1/Op2]
connect_bd_net [get_bd_pins util_vector_logic_1/Res] [get_bd_pins valid_sqrt] [get_bd_pins c_shift_ram_0/CE]
connect_bd_net -net processing_system7_0_FCLK_CLK1 [get_bd_pins CLK] \
  [get_bd_pins c_shift_ram_0/CLK] [get_bd_pins cordic_0/aclk] [get_bd_pins cordic_1/aclk]
connect_bd_net -net avg_err_state_s_5 [get_bd_pins s_root] \
  [get_bd_pins cordic_0/s_axis_cartesian_tvalid] [get_bd_pins cordic_1/s_axis_cartesian_tvalid]
connect_bd_net [get_bd_pins cordic_0/m_axis_dout_tdata] [get_bd_pins mult_gen_0/A]
connect_bd_net [get_bd_pins cordic_1/m_axis_dout_tdata] [get_bd_pins mult_gen_0/B]
connect_bd_net [get_bd_pins mult_gen_0/P] [get_bd_pins c_shift_ram_0/D]
connect_bd_net [get_bd_pins c_shift_ram_0/Q] [get_bd_pins norm]
connect_bd_net -net num0_1 [get_bd_pins num0] [get_bd_pins xlslice_0/Din]
connect_bd_net [get_bd_pins xlslice_0/Dout] [get_bd_pins xlconcat_0/In1]
connect_bd_net [get_bd_pins xlconcat_0/dout] [get_bd_pins cordic_0/s_axis_cartesian_tdata]
connect_bd_net [get_bd_pins xlconstant_0/dout] [get_bd_pins xlconcat_0/In0] [get_bd_pins xlconcat_1/In0]
connect_bd_net -net num1_1 [get_bd_pins num1] [get_bd_pins xlslice_1/Din]
connect_bd_net [get_bd_pins xlslice_1/Dout] [get_bd_pins xlconcat_1/In1]
connect_bd_net [get_bd_pins xlconcat_1/dout] [get_bd_pins cordic_1/s_axis_cartesian_tdata]

current_bd_instance /datapath/zncc_cont
connect_bd_net [get_bd_pins cc] [get_bd_pins xlconcat_0/In1]
connect_bd_net [get_bd_pins xlconstant_0/dout] [get_bd_pins xlconcat_0/In0]
connect_bd_net [get_bd_pins div_gen_0/m_axis_dout_tvalid] [get_bd_pins valid_zncc] [get_bd_pins c_shift_ram_2/CE]
connect_bd_net [get_bd_pins CLK] [get_bd_pins c_shift_ram_2/CLK] [get_bd_pins div_gen_0/aclk]
connect_bd_net [get_bd_pins xlslice_0_ok/Dout] [get_bd_pins c_shift_ram_2/D]
connect_bd_net [get_bd_pins c_shift_ram_2/Q] [get_bd_pins zncc]
connect_bd_net [get_bd_pins norm] [get_bd_pins div_gen_0/s_axis_divisor_tdata]
connect_bd_net [get_bd_pins s_zncc] [get_bd_pins div_gen_0/s_axis_divisor_tvalid] [get_bd_pins div_gen_0/s_axis_dividend_tvalid]
connect_bd_net [get_bd_pins xlconcat_0/dout] [get_bd_pins div_gen_0/s_axis_dividend_tdata]
connect_bd_net [get_bd_pins div_gen_0/m_axis_dout_tdata] [get_bd_pins xlslice_0_ok/Din]

current_bd_instance /datapath/bram_res
connect_bd_intf_net [get_bd_intf_pins BRAM_PORTA] [get_bd_intf_pins axi_bram_ctrl_2_bram/BRAM_PORTA]
connect_bd_net [get_bd_pins CLK] [get_bd_pins axi_bram_ctrl_2_bram/clkb]
connect_bd_net [get_bd_pins zncc_val] [get_bd_pins axi_bram_ctrl_2_bram/dinb]
connect_bd_net [get_bd_pins save] \
  [get_bd_pins axi_bram_ctrl_2_bram/enb] [get_bd_pins xlconcat_0/In0] [get_bd_pins xlconcat_0/In1] \
  [get_bd_pins xlconcat_0/In2] [get_bd_pins xlconcat_0/In3]
connect_bd_net [get_bd_pins xlconcat_0/dout] [get_bd_pins axi_bram_ctrl_2_bram/web]
connect_bd_net [get_bd_pins index] [get_bd_pins axi_bram_ctrl_2_bram/addrb]

current_bd_instance /datapath/index_cont
connect_bd_net -net processing_system7_0_FCLK_CLK1 [get_bd_pins CLK] [get_bd_pins c_counter_binary_0/CLK]
connect_bd_net [get_bd_pins s_done] [get_bd_pins c_counter_binary_0/CE]
connect_bd_net [get_bd_pins c_counter_binary_0/Q] [get_bd_pins index]
connect_bd_net [get_bd_pins SCLR] [get_bd_pins c_counter_binary_0/SCLR]

current_bd_instance /datapath/max_cont
connect_bd_net [get_bd_pins index] [get_bd_pins xlslice_1/Din] [get_bd_pins util_reduced_logic_0/Op1]
connect_bd_net [get_bd_pins CLK] [get_bd_pins c_shift_ram_0/CLK] [get_bd_pins c_shift_ram_1/CLK]
connect_bd_net [get_bd_pins SCLR] [get_bd_pins c_shift_ram_0/SCLR] [get_bd_pins c_shift_ram_1/SCLR]
connect_bd_net [get_bd_pins value] [get_bd_pins c_shift_ram_1/D] [get_bd_pins c_addsub_0/B]
connect_bd_net [get_bd_pins compare] [get_bd_pins util_vector_logic_0/Op1]
connect_bd_net [get_bd_pins util_vector_logic_0/Res] [get_bd_pins c_shift_ram_0/CE] [get_bd_pins c_shift_ram_1/CE]
connect_bd_net [get_bd_pins c_shift_ram_1/Q] [get_bd_pins c_addsub_0/A]
connect_bd_net [get_bd_pins c_addsub_0/S] [get_bd_pins xlslice_0/Din]
connect_bd_net [get_bd_pins c_shift_ram_0/Q] [get_bd_pins max_index]
connect_bd_net [get_bd_pins xlslice_0/Dout] [get_bd_pins util_vector_logic_1/Op1]
connect_bd_net [get_bd_pins xlslice_1/Dout] [get_bd_pins xlconcat_0/In0]
connect_bd_net [get_bd_pins xlconstant_0/dout] [get_bd_pins xlconcat_0/In1]
connect_bd_net [get_bd_pins xlconcat_0/dout] [get_bd_pins c_shift_ram_0/D]
connect_bd_net [get_bd_pins util_vector_logic_1/Res] [get_bd_pins util_vector_logic_0/Op2]
connect_bd_net [get_bd_pins util_reduced_logic_0/Res] [get_bd_pins util_vector_logic_2/Op1]
connect_bd_net [get_bd_pins util_vector_logic_2/Res] [get_bd_pins util_vector_logic_1/Op2]

current_bd_instance /
connect_bd_intf_net [get_bd_intf_pins processing_system7_0/M_AXI_GP0] [get_bd_intf_pins axi_smc/S00_AXI]
connect_bd_intf_net [get_bd_intf_pins axi_smc/M00_AXI] [get_bd_intf_pins axi_bram_ctrl_0/S_AXI]
connect_bd_intf_net [get_bd_intf_pins datapath/BRAM_PORTA1] [get_bd_intf_pins axi_bram_ctrl_0/BRAM_PORTA]
connect_bd_intf_net [get_bd_intf_pins axi_smc/M01_AXI] [get_bd_intf_pins axi_gpio_0/S_AXI]
connect_bd_intf_net [get_bd_intf_pins axi_smc/M02_AXI] [get_bd_intf_pins axi_gpio_1/S_AXI]
connect_bd_intf_net [get_bd_intf_pins axi_smc/M03_AXI] [get_bd_intf_pins axi_gpio_2/S_AXI]
connect_bd_intf_net -intf_net axi_bram_ctrl_0_BRAM_PORTA1 [get_bd_intf_pins datapath/BRAM_PORTA0] [get_bd_intf_pins axi_bram_ctrl_1/BRAM_PORTA]
connect_bd_intf_net [get_bd_intf_pins axi_smc/M04_AXI] [get_bd_intf_pins axi_bram_ctrl_1/S_AXI]
connect_bd_intf_net [get_bd_intf_pins axi_smc/M05_AXI] [get_bd_intf_pins axi_bram_ctrl_2/S_AXI]
connect_bd_intf_net [get_bd_intf_pins axi_bram_ctrl_2/BRAM_PORTA] [get_bd_intf_pins datapath/BRAM_PORTA2]
connect_bd_intf_net [get_bd_intf_ports DDR] [get_bd_intf_pins processing_system7_0/DDR]
connect_bd_intf_net [get_bd_intf_ports FIXED_IO] [get_bd_intf_pins processing_system7_0/FIXED_IO]
connect_bd_intf_net [get_bd_intf_ports sys_diff_clock] [get_bd_intf_pins clk_wiz_0/CLK_IN1_D]
connect_bd_net -net processing_system7_0_FCLK_CLK0 [get_bd_pins clk_wiz_0/clk_out2] \
  [get_bd_pins processing_system7_0/M_AXI_GP0_ACLK] [get_bd_pins axi_smc/aclk] [get_bd_pins axi_bram_ctrl_0/s_axi_aclk] \
  [get_bd_pins rst_ps7_0_50M/slowest_sync_clk] [get_bd_pins axi_gpio_0/s_axi_aclk] [get_bd_pins axi_gpio_1/s_axi_aclk] \
  [get_bd_pins axi_gpio_2/s_axi_aclk] [get_bd_pins axi_bram_ctrl_1/s_axi_aclk] [get_bd_pins axi_bram_ctrl_2/s_axi_aclk]
connect_bd_net [get_bd_pins processing_system7_0/FCLK_RESET0_N] [get_bd_pins rst_ps7_0_50M/ext_reset_in]
connect_bd_net [get_bd_pins rst_ps7_0_50M/peripheral_aresetn] \
  [get_bd_pins axi_bram_ctrl_0/s_axi_aresetn] [get_bd_pins axi_smc/aresetn] [get_bd_pins axi_gpio_0/s_axi_aresetn] \
  [get_bd_pins axi_gpio_1/s_axi_aresetn] [get_bd_pins axi_gpio_2/s_axi_aresetn] [get_bd_pins axi_bram_ctrl_1/s_axi_aresetn] \
  [get_bd_pins axi_bram_ctrl_2/s_axi_aresetn]
connect_bd_net -net processing_system7_0_FCLK_CLK1 [get_bd_pins clk_wiz_0/clk_out1] [get_bd_pins control_unit/CLK] [get_bd_pins datapath/CLK]
connect_bd_net -net avg_cont_avg [get_bd_pins datapath/max_index] [get_bd_pins axi_gpio_0/gpio_io_i]
connect_bd_net -net avg_cont1_avg [get_bd_pins datapath/debug_2] [get_bd_pins axi_gpio_2/gpio_io_i]
connect_bd_net [get_bd_ports reset] [get_bd_pins clk_wiz_0/reset]
connect_bd_net -net do_cycle_1 [get_bd_pins datapath/do_cycle] [get_bd_pins control_unit/do_cycle]
connect_bd_net -net avg_err_state_s_3 [get_bd_pins control_unit/s_restart] [get_bd_pins datapath/s_restart]
connect_bd_net -net acc_state_s_2 [get_bd_pins control_unit/s_acc] [get_bd_pins datapath/s_acc]
connect_bd_net -net acc_state_s_3 [get_bd_pins control_unit/s_addr] [get_bd_pins datapath/s_addr]
connect_bd_net -net len_cont_not_zero [get_bd_pins datapath/len_not_zero] [get_bd_pins control_unit/len_not_zero]
connect_bd_net -net cycle_cont_stop_cycle [get_bd_pins datapath/stop_cycle] [get_bd_pins control_unit/stop_cycle]
connect_bd_net -net util_vector_logic_0_Res [get_bd_pins datapath/valid_div] [get_bd_pins control_unit/valid_div]
connect_bd_net -net util_vector_logic_1_Res [get_bd_pins datapath/valid_sqrt] [get_bd_pins control_unit/valid_sqrt]
connect_bd_net -net avg_err_state_s_5 [get_bd_pins control_unit/s_root] [get_bd_pins datapath/s_root]
connect_bd_net -net avg_err_state_s_4 [get_bd_pins control_unit/s_square] [get_bd_pins datapath/s_square]
connect_bd_net -net avg_err_state_s_2 [get_bd_pins control_unit/s_avg] [get_bd_pins datapath/s_avg]
connect_bd_net -net avg_err_state_s_0 [get_bd_pins control_unit/s_wait] [get_bd_pins datapath/s_wait]
connect_bd_net -net addr_zero_1 [get_bd_pins datapath/addr_zero] [get_bd_pins control_unit/addr_zero]
connect_bd_net -net s_zncc_1 [get_bd_pins control_unit/s_zncc] [get_bd_pins datapath/s_zncc]
connect_bd_net -net valid_zncc_1 [get_bd_pins datapath/valid_zncc] [get_bd_pins control_unit/valid_zncc]
connect_bd_net [get_bd_pins control_unit/s_done] [get_bd_pins datapath/s_done]
connect_bd_net [get_bd_pins datapath/clear] [get_bd_pins control_unit/SCLR]
connect_bd_net [get_bd_pins control_unit/states] [get_bd_pins axi_gpio_1/gpio_io_i]

# ---- address map ----
assign_bd_address -offset 0x40000000 -range 8K -target_address_space [get_bd_addr_spaces processing_system7_0/Data] [get_bd_addr_segs axi_bram_ctrl_0/S_AXI/Mem0]
assign_bd_address -offset 0x41200000 -range 64K -target_address_space [get_bd_addr_spaces processing_system7_0/Data] [get_bd_addr_segs axi_gpio_0/S_AXI/Reg]
assign_bd_address -offset 0x41210000 -range 64K -target_address_space [get_bd_addr_spaces processing_system7_0/Data] [get_bd_addr_segs axi_gpio_1/S_AXI/Reg]
assign_bd_address -offset 0x41220000 -range 64K -target_address_space [get_bd_addr_spaces processing_system7_0/Data] [get_bd_addr_segs axi_gpio_2/S_AXI/Reg]
assign_bd_address -offset 0x42000000 -range 8K -target_address_space [get_bd_addr_spaces processing_system7_0/Data] [get_bd_addr_segs axi_bram_ctrl_1/S_AXI/Mem0]
assign_bd_address -offset 0x44000000 -range 8K -target_address_space [get_bd_addr_spaces processing_system7_0/Data] [get_bd_addr_segs axi_bram_ctrl_2/S_AXI/Mem0]

validate_bd_design
save_bd_design
